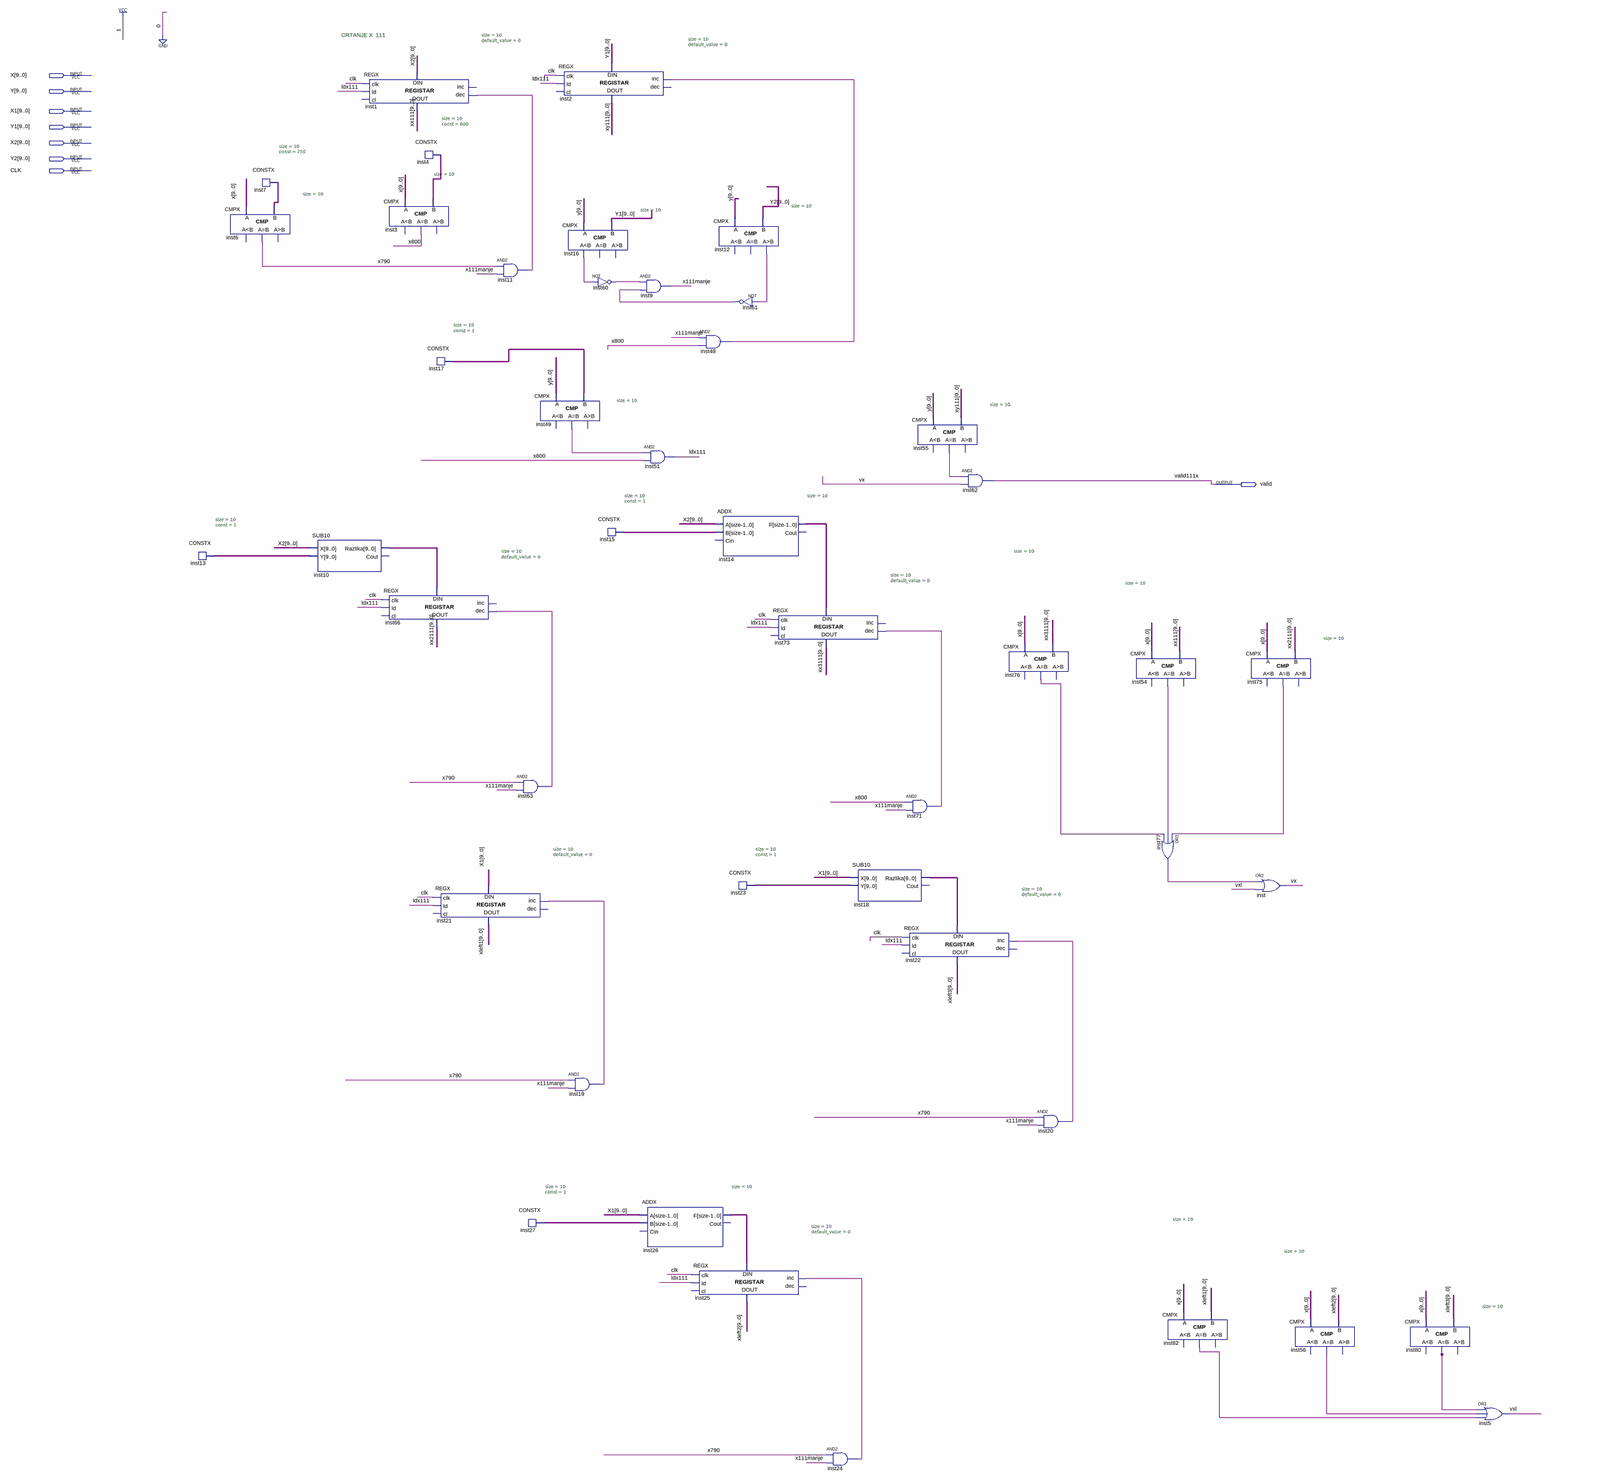
[diagram p0: schematic sheet, whole]
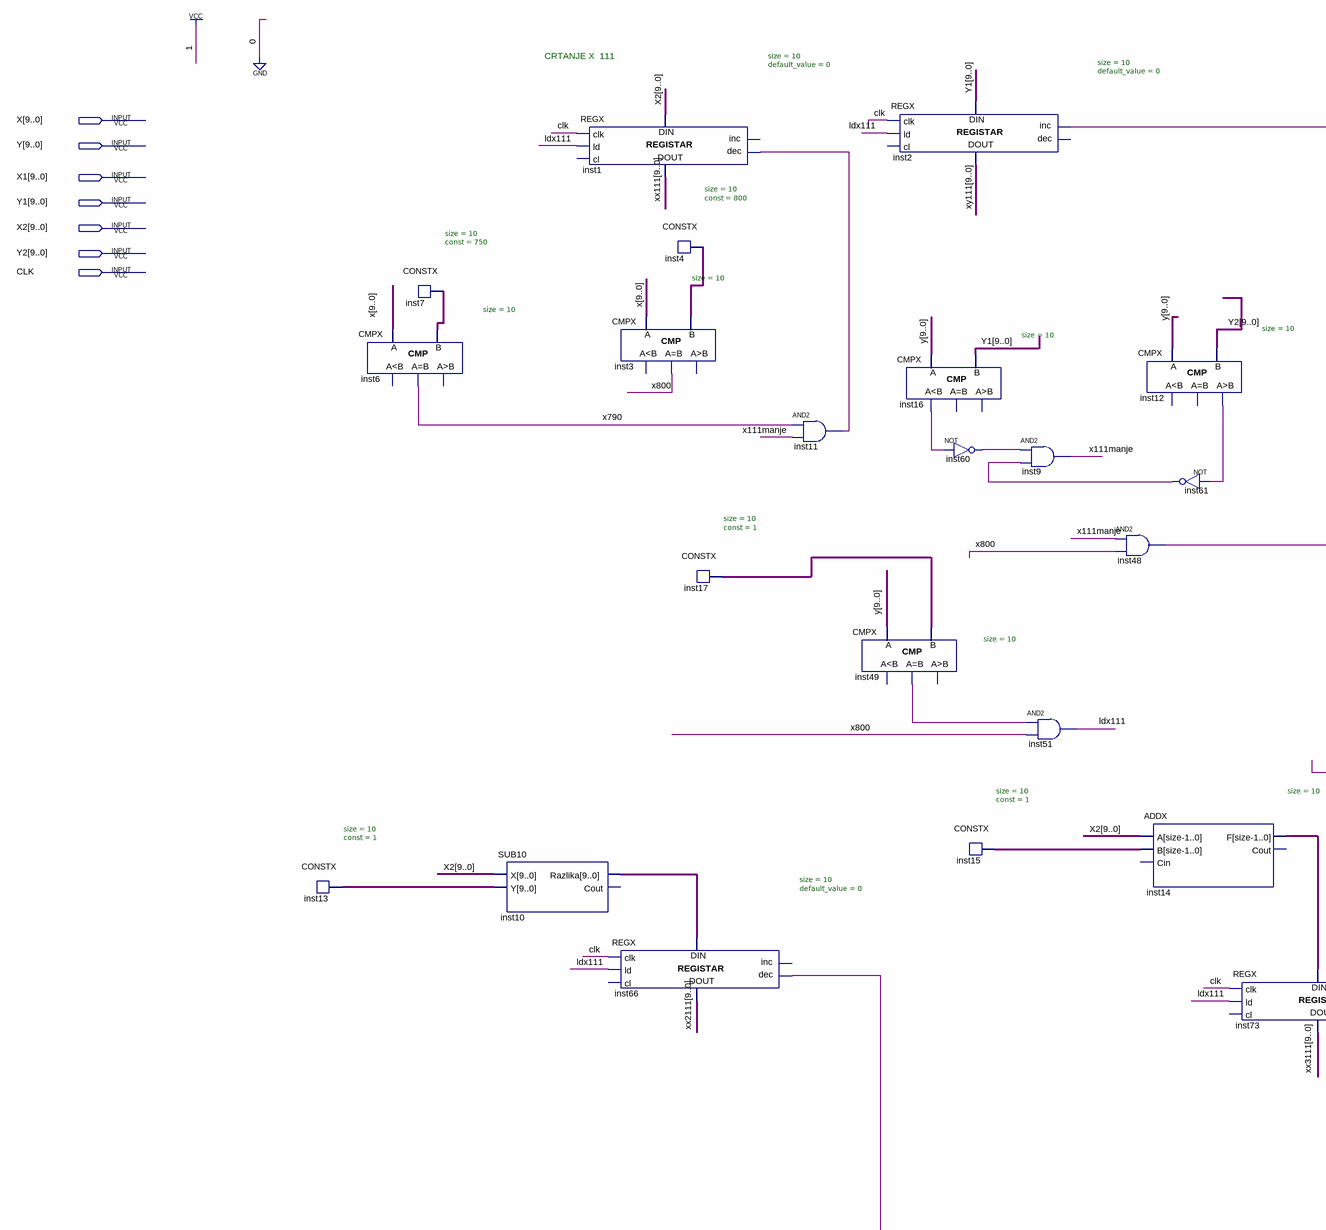
[diagram p1: schematic sheet, upper left part]
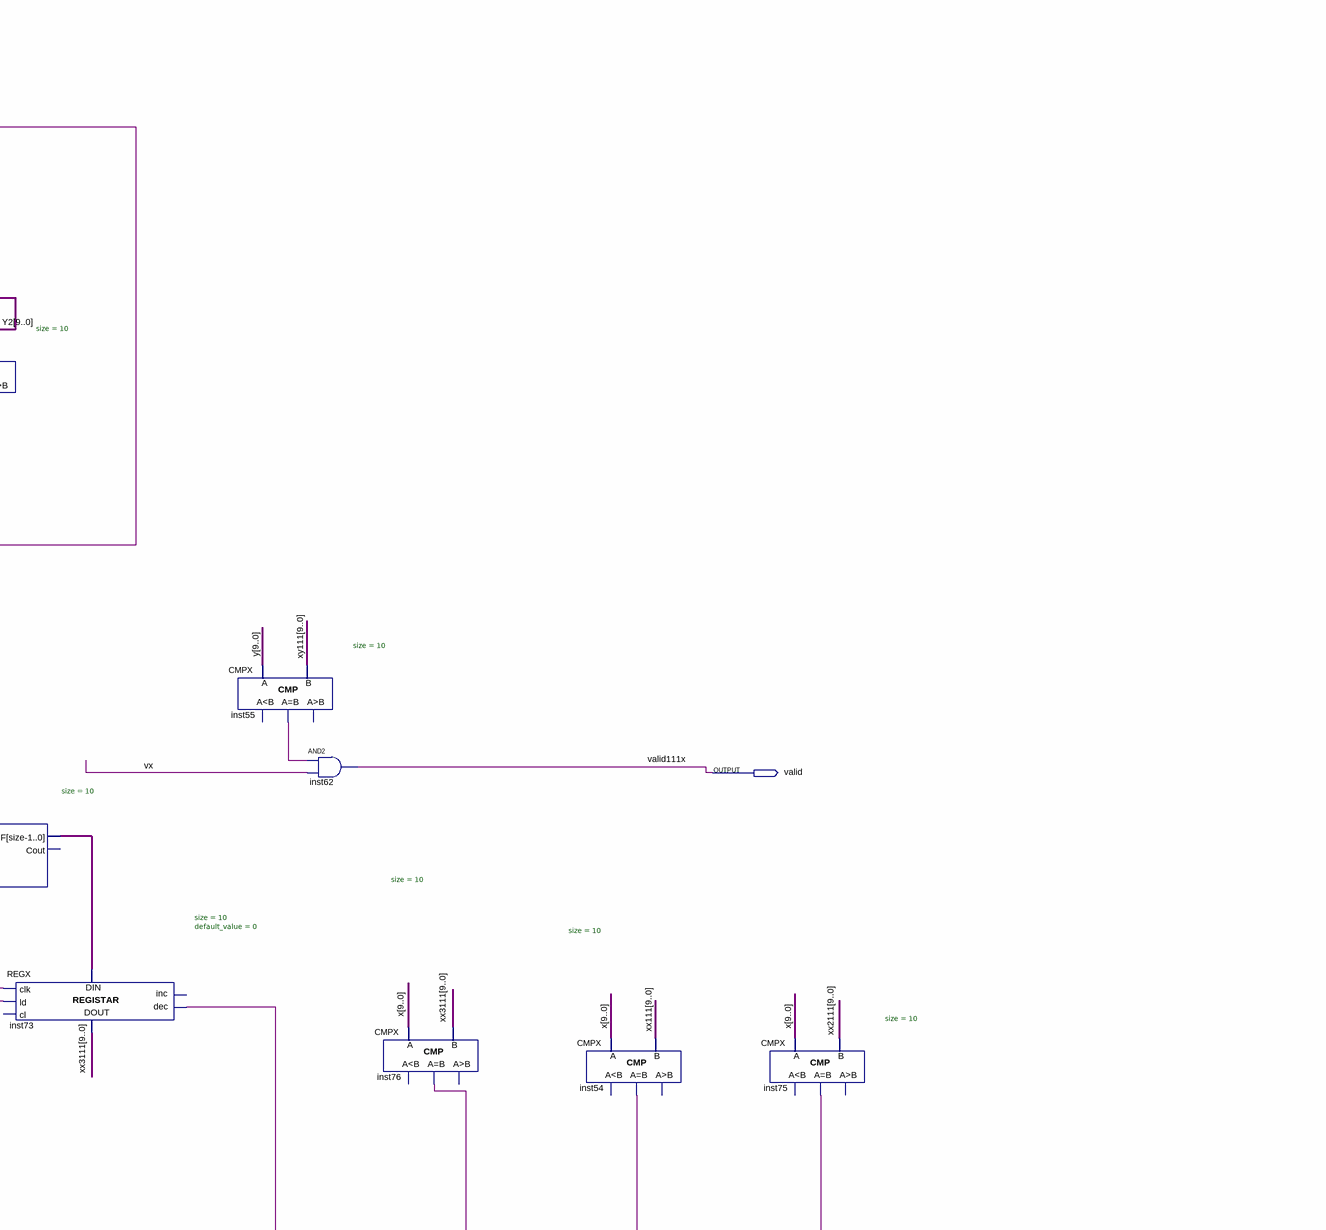
[diagram p2: schematic sheet, upper right part]
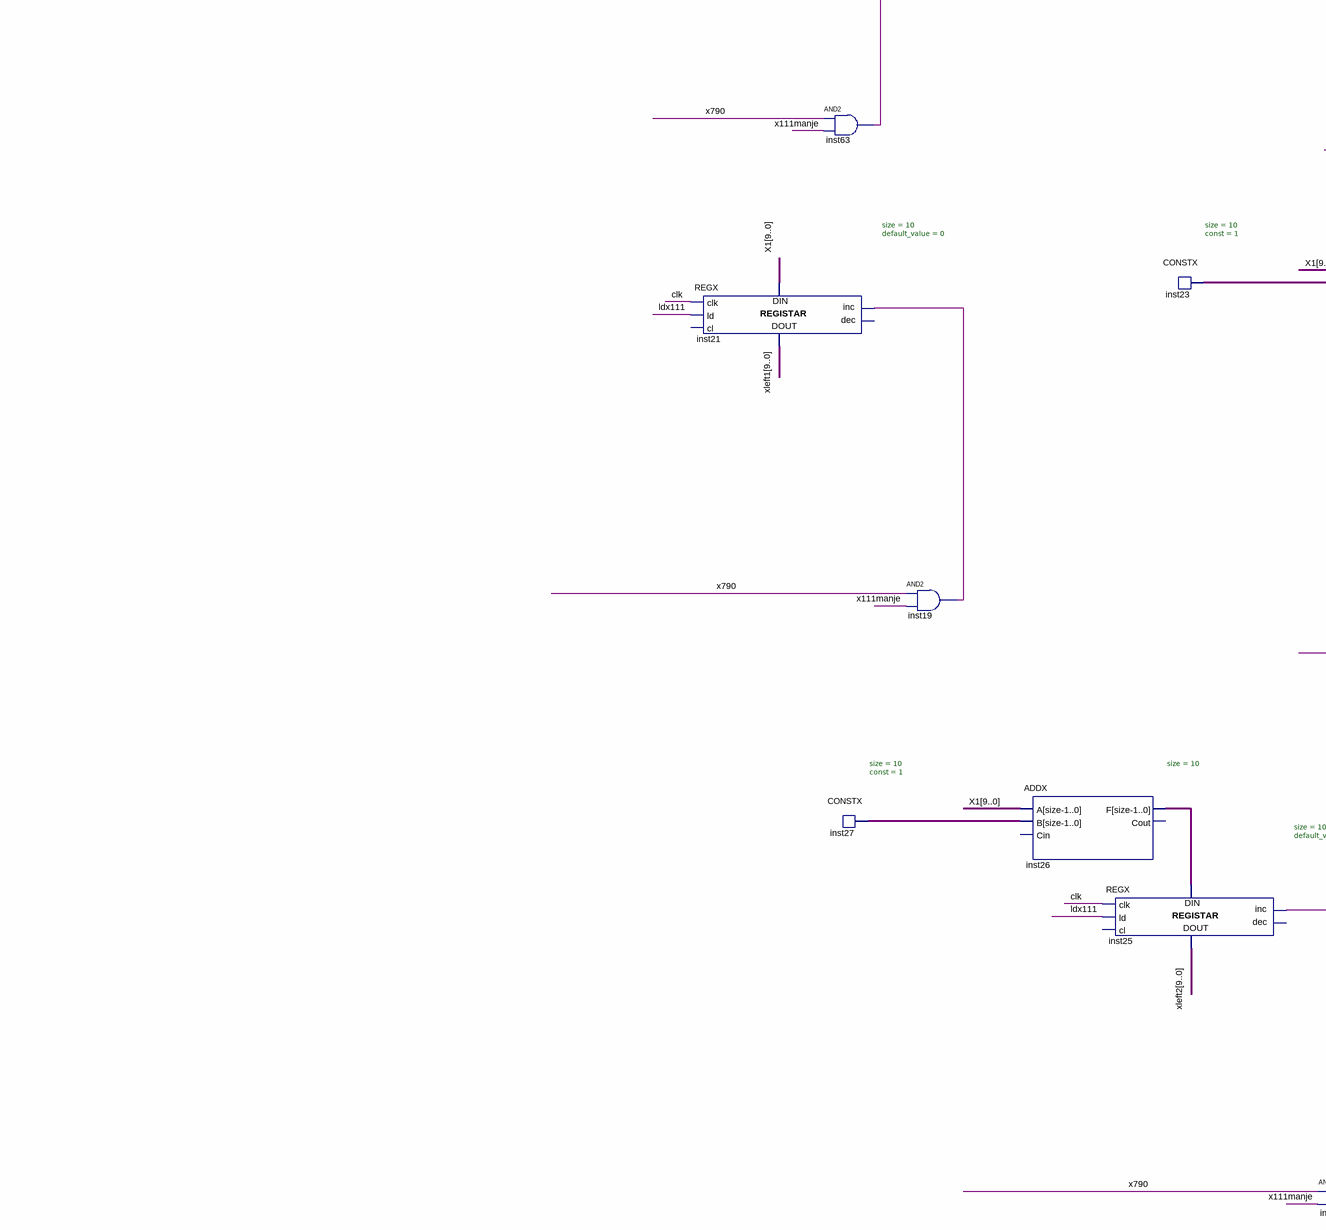
[diagram p3: schematic sheet, lower left part]
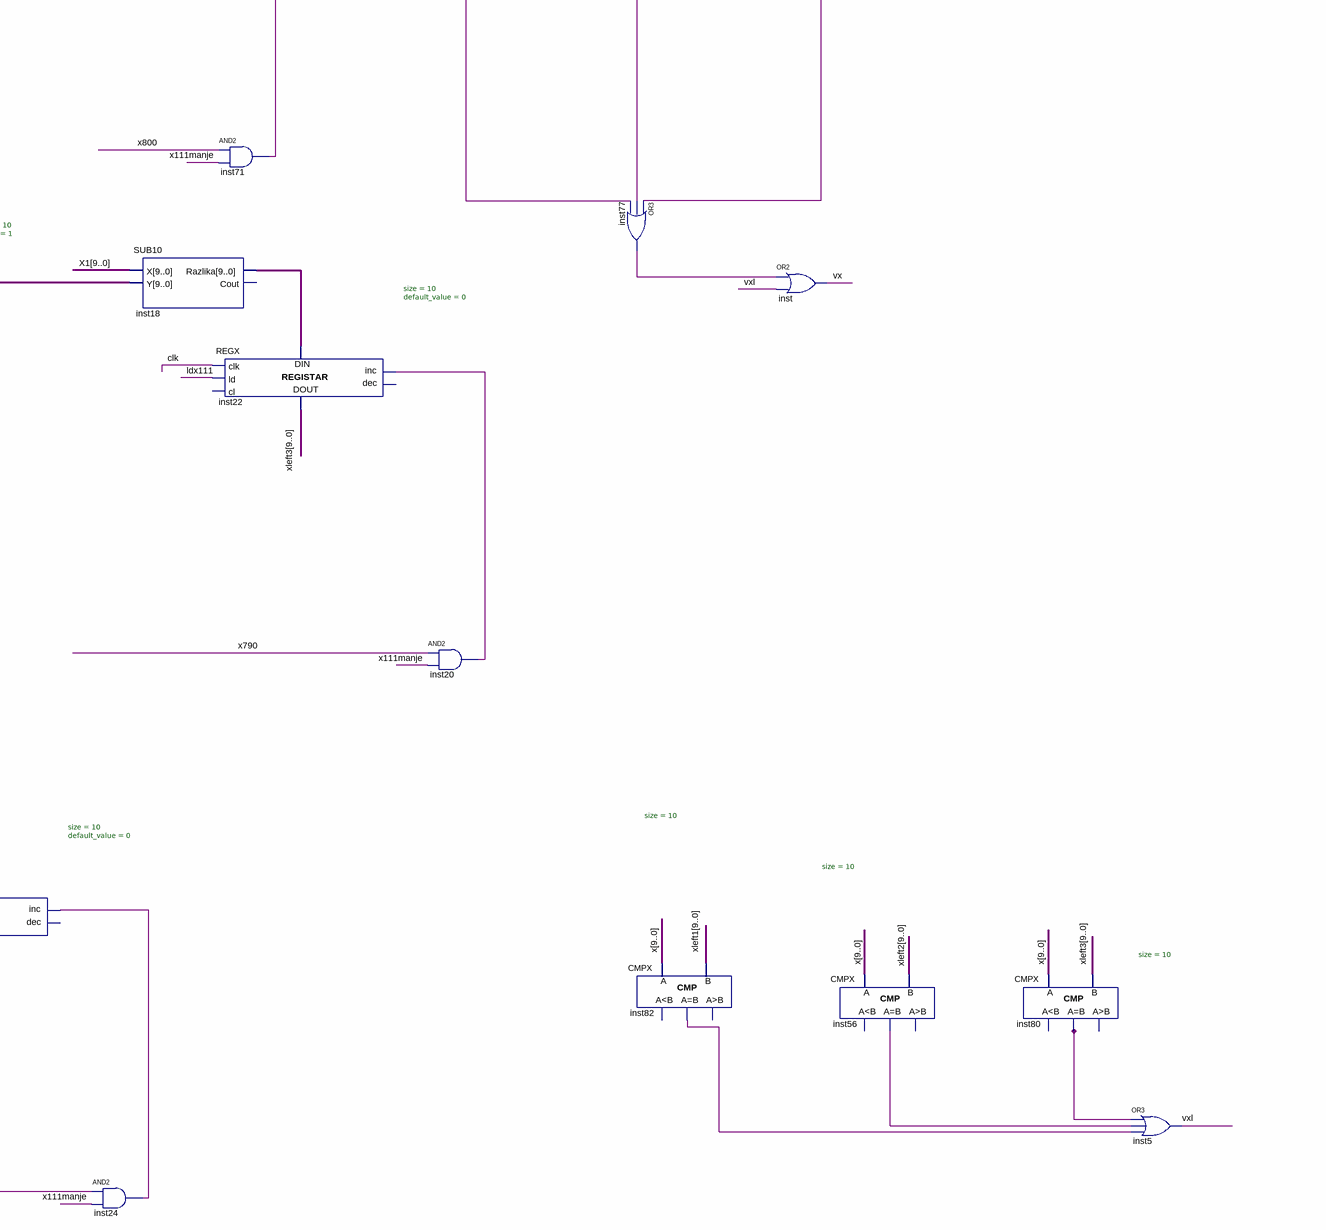
[diagram p4: schematic sheet, lower right part]
// Quartus schematic XCrtanjeLS.bdf as structural Verilog: 45 symbols, 8 pins
module XCrtanjeLS (
  input  [9:0] X,
  input  [9:0] Y,
  input  [9:0] X1,
  input  [9:0] Y1,
  input  [9:0] X2,
  input  [9:0] Y2,
  input  CLK,
  output valid
);

  wire inst11_out, inst12_gr, inst16_ls, inst19_out, inst20_out, inst24_out, inst48_out, inst49_eq,
       inst54_eq, inst55_eq, inst56_eq, inst60_out, inst61_out, inst63_out, inst71_out, inst75_eq, inst76_eq,
       inst77_out, inst80_eq, inst82_eq, ldx111, vx, vxl, x111manje, x790, x800;
  wire [9:0] inst4_data, inst7_data, inst10_razlika, inst13_data, inst14_f, inst15_data, inst17_data,
       inst18_razlika, inst23_data, inst26_f, inst27_data, xleft1, xleft2, xleft3, xx111, xx2111, xx3111,
       xy111;

  CONSTX #(.size(10), .\const (1)) inst13 (.data(inst13_data));
  CONSTX #(.size(10), .\const (750)) inst7 (.data(inst7_data));
  CMPX #(.size(10)) inst6 (.A(X), .B(inst7_data), .eq(x790));  // open: ls, gr
  SUB10 inst10 (.X(X2), .Y(inst13_data), .Razlika(inst10_razlika));  // open: Cout
  REGX #(.size(10), .default_value(0)) inst1 (
    .clk(CLK), .ld(ldx111), .dec(inst11_out), .data_in(X2), .data_out(xx111));  // open: cl, inc
  CMPX #(.size(10)) inst3 (.A(X), .B(inst4_data), .eq(x800));  // open: ls, gr
  REGX #(.size(10), .default_value(0)) inst66 (
    .clk(CLK), .ld(ldx111), .dec(inst63_out), .data_in(inst10_razlika), .data_out(xx2111));  // open: cl, inc
  CONSTX #(.size(10), .\const (800)) inst4 (.data(inst4_data));
  CONSTX #(.size(10), .\const (1)) inst17 (.data(inst17_data));
  REGX #(.size(10), .default_value(0)) inst21 (
    .clk(CLK), .ld(ldx111), .inc(inst19_out), .data_in(X1), .data_out(xleft1));  // open: cl, dec
  and inst11 (inst11_out, x790, x111manje);
  CMPX #(.size(10)) inst49 (.A(Y), .B(inst17_data), .eq(inst49_eq));  // open: ls, gr
  and inst63 (inst63_out, x790, x111manje);
  CONSTX #(.size(10), .\const (1)) inst27 (.data(inst27_data));
  REGX #(.size(10), .default_value(0)) inst2 (
    .clk(CLK), .ld(ldx111), .inc(inst48_out), .data_in(Y1), .data_out(xy111));  // open: cl, dec
  CMPX #(.size(10)) inst16 (.A(Y), .B(Y1), .ls(inst16_ls));  // open: eq, gr
  and inst19 (inst19_out, x790, x111manje);
  not inst60 (inst60_out, inst16_ls);
  CONSTX #(.size(10), .\const (1)) inst15 (.data(inst15_data));
  and inst9 (x111manje, inst60_out, inst61_out);
  and inst51 (ldx111, inst49_eq, x800);
  ADDX #(.size(10)) inst26 (.A(X1), .B(inst27_data), .F(inst26_f));  // open: Cin, Cout
  REGX #(.size(10), .default_value(0)) inst25 (
    .clk(CLK), .ld(ldx111), .inc(inst24_out), .data_in(inst26_f), .data_out(xleft2));  // open: cl, dec
  CMPX #(.size(10)) inst12 (.A(Y), .B(Y2), .gr(inst12_gr));  // open: ls, eq
  and inst48 (inst48_out, x111manje, x800);
  ADDX #(.size(10)) inst14 (.A(X2), .B(inst15_data), .F(inst14_f));  // open: Cin, Cout
  CONSTX #(.size(10), .\const (1)) inst23 (.data(inst23_data));
  not inst61 (inst61_out, inst12_gr);
  REGX #(.size(10), .default_value(0)) inst73 (
    .clk(CLK), .ld(ldx111), .dec(inst71_out), .data_in(inst14_f), .data_out(xx3111));  // open: cl, inc
  SUB10 inst18 (.X(X1), .Y(inst23_data), .Razlika(inst18_razlika));  // open: Cout
  and inst24 (inst24_out, x790, x111manje);
  CMPX #(.size(10)) inst55 (.A(Y), .B(xy111), .eq(inst55_eq));  // open: ls, gr
  and inst71 (inst71_out, x800, x111manje);
  REGX #(.size(10), .default_value(0)) inst22 (
    .clk(CLK), .ld(ldx111), .inc(inst20_out), .data_in(inst18_razlika), .data_out(xleft3));  // open: cl, dec
  and inst62 (valid, inst55_eq, vx);
  CMPX #(.size(10)) inst76 (.A(X), .B(xx3111), .eq(inst76_eq));  // open: ls, gr
  and inst20 (inst20_out, x790, x111manje);
  CMPX #(.size(10)) inst54 (.A(X), .B(xx111), .eq(inst54_eq));  // open: ls, gr
  or inst77 (inst77_out, inst75_eq, inst54_eq, inst76_eq);
  CMPX #(.size(10)) inst82 (.A(X), .B(xleft1), .eq(inst82_eq));  // open: ls, gr
  CMPX #(.size(10)) inst75 (.A(X), .B(xx2111), .eq(inst75_eq));  // open: ls, gr
  or inst (vx, inst77_out, vxl);
  CMPX #(.size(10)) inst56 (.A(X), .B(xleft2), .eq(inst56_eq));  // open: ls, gr
  CMPX #(.size(10)) inst80 (.A(X), .B(xleft3), .eq(inst80_eq));  // open: ls, gr
  or inst5 (vxl, inst80_eq, inst56_eq, inst82_eq);

  // Other names for the same wires on the sheet: valid111x = valid

  // Notes on the sheet:
  //   CRTANJE X  111          
endmodule
